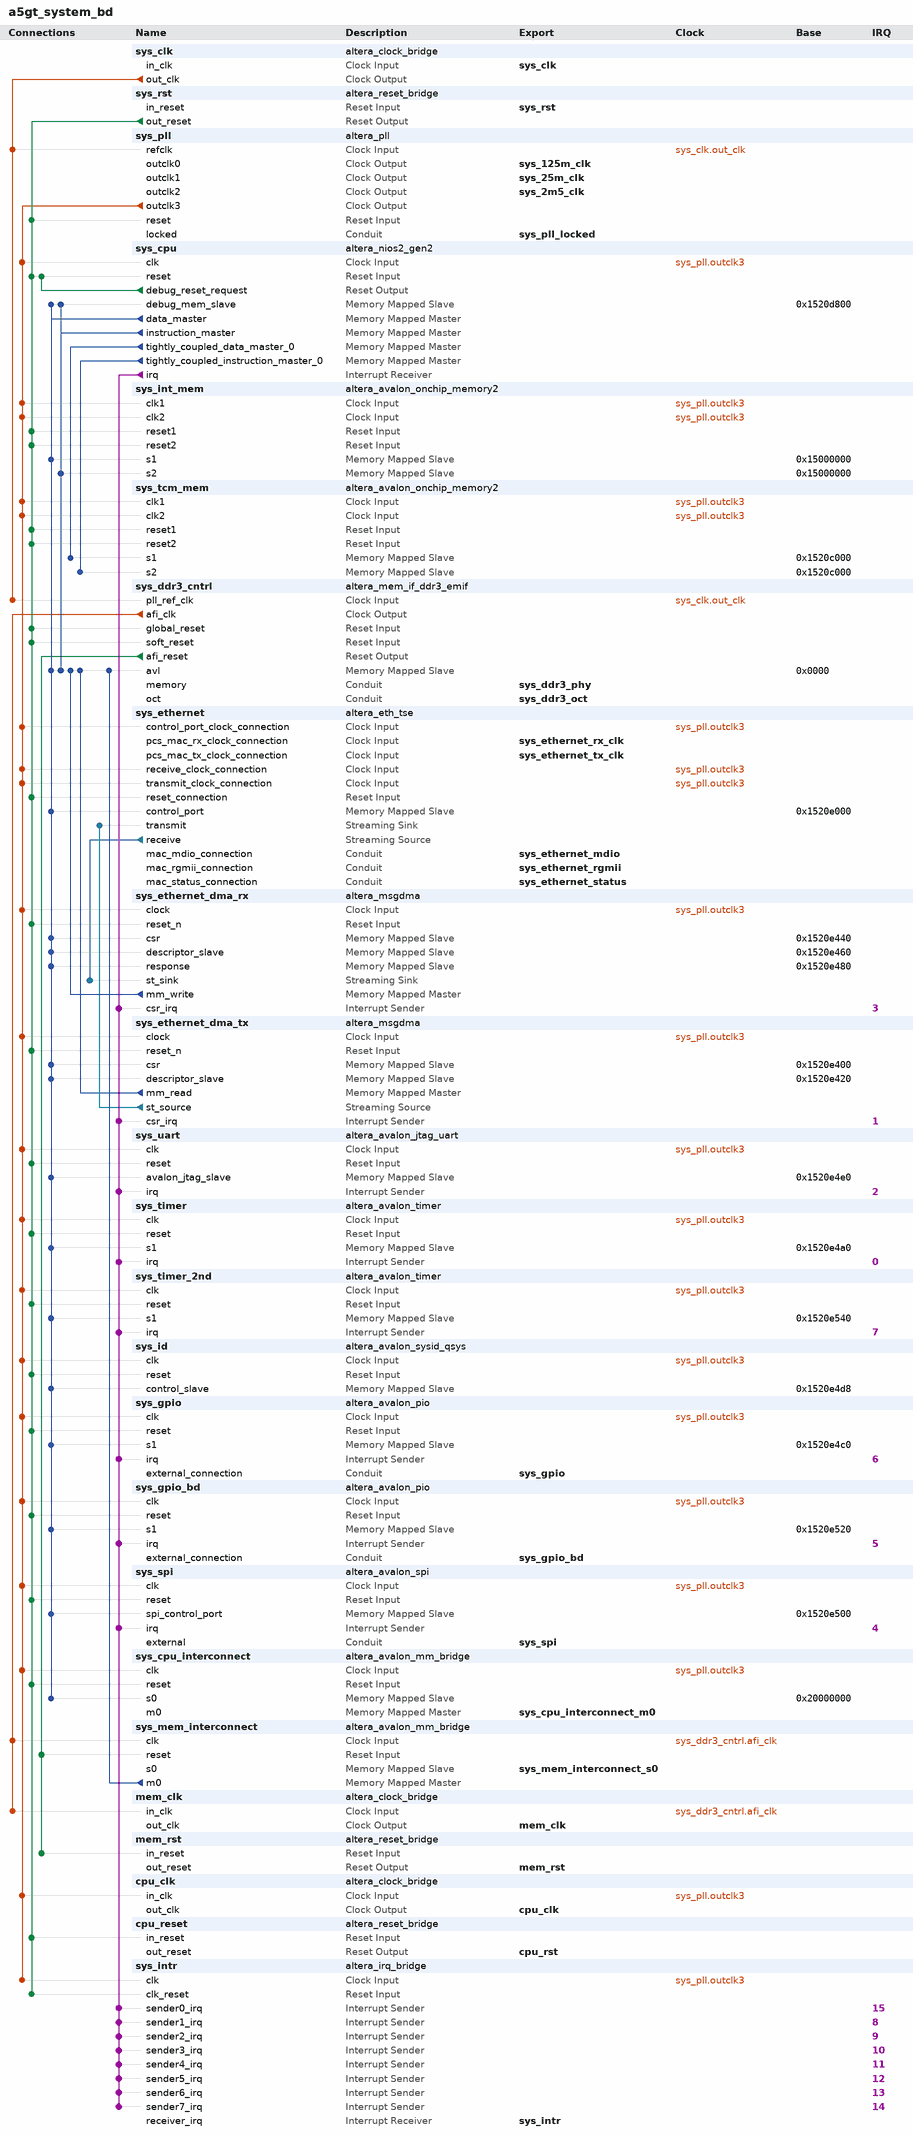
[diagram p0: system contents]
# Platform Designer (Qsys) system a5gt_system_bd, Arria V 5AGTFD7K3F40I3
# Parameters at their usual value, and those the tool derives, are not listed.
package require -exact qsys 15.1
create_system a5gt_system_bd
set_project_property DEVICE_FAMILY {Arria V}
set_project_property DEVICE 5AGTFD7K3F40I3

add_instance sys_clk altera_clock_bridge 15.1
set_instance_parameter_value sys_clk DERIVED_CLOCK_RATE 0
set_instance_parameter_value sys_clk EXPLICIT_CLOCK_RATE 1000000000

add_instance sys_rst altera_reset_bridge 15.1
set_instance_parameter_value sys_rst ACTIVE_LOW_RESET 0
set_instance_parameter_value sys_rst SYNCHRONOUS_EDGES none

add_instance sys_pll altera_pll 15.1
set_instance_parameter_value sys_pll gui_actual_output_clock_frequency1 {166.666666 MHz}
set_instance_parameter_value sys_pll gui_device_speed_grade 2
set_instance_parameter_value sys_pll gui_number_of_clocks 4
set_instance_parameter_value sys_pll gui_operation_mode direct
set_instance_parameter_value sys_pll gui_output_clock_frequency0 125.0
set_instance_parameter_value sys_pll gui_output_clock_frequency1 25.0
set_instance_parameter_value sys_pll gui_output_clock_frequency2 2.5
set_instance_parameter_value sys_pll gui_output_clock_frequency3 100.0
set_instance_parameter_value sys_pll gui_pll_mode {Integer-N PLL}
set_instance_parameter_value sys_pll gui_reference_clock_frequency 100.0
set_instance_parameter_value sys_pll gui_use_locked true

add_instance sys_cpu altera_nios2_gen2 15.1
set_instance_parameter_value sys_cpu dcache_numTCDM 1
set_instance_parameter_value sys_cpu dcache_size 32768
set_instance_parameter_value sys_cpu exceptionSlave sys_ddr3_cntrl.avl
set_instance_parameter_value sys_cpu icache_numTCIM 1
set_instance_parameter_value sys_cpu icache_size 32768
set_instance_parameter_value sys_cpu impl Fast
set_instance_parameter_value sys_cpu mmu_TLBMissExcOffset 4096
set_instance_parameter_value sys_cpu mmu_TLBMissExcSlave sys_int_mem.s2
set_instance_parameter_value sys_cpu mmu_autoAssignTlbPtrSz false
set_instance_parameter_value sys_cpu mmu_enabled true
set_instance_parameter_value sys_cpu mul_32_impl 3
set_instance_parameter_value sys_cpu resetSlave sys_ddr3_cntrl.avl
set_instance_parameter_value sys_cpu setting_activateTrace true
set_instance_parameter_value sys_cpu shift_rot_impl 0

add_instance sys_int_mem altera_avalon_onchip_memory2 15.1
set_instance_parameter_value sys_int_mem dataWidth 32
set_instance_parameter_value sys_int_mem dualPort true
set_instance_parameter_value sys_int_mem initMemContent true
set_instance_parameter_value sys_int_mem initializationFileName onchip_mem.hex
set_instance_parameter_value sys_int_mem memorySize 786432

add_instance sys_tcm_mem altera_avalon_onchip_memory2 15.1
set_instance_parameter_value sys_tcm_mem dataWidth 32
set_instance_parameter_value sys_tcm_mem dualPort true
set_instance_parameter_value sys_tcm_mem initMemContent true
set_instance_parameter_value sys_tcm_mem initializationFileName onchip_mem.hex
set_instance_parameter_value sys_tcm_mem memorySize 4096

add_instance sys_ddr3_cntrl altera_mem_if_ddr3_emif 15.1
set_instance_parameter_value sys_ddr3_cntrl AVL_MAX_SIZE 256
set_instance_parameter_value sys_ddr3_cntrl CALIBRATION_MODE Skip
set_instance_parameter_value sys_ddr3_cntrl CPORT_TYPE_PORT Bidirectional,Bidirectional,Bidirectional,Bidirectional,Bidirectional,Bidirectional
set_instance_parameter_value sys_ddr3_cntrl EXPORT_AFI_HALF_CLK false
set_instance_parameter_value sys_ddr3_cntrl HARD_EMIF false
set_instance_parameter_value sys_ddr3_cntrl MEM_BANKADDR_WIDTH 3
set_instance_parameter_value sys_ddr3_cntrl MEM_CLK_FREQ 400.0
set_instance_parameter_value sys_ddr3_cntrl MEM_CLK_FREQ_MAX 666.667
set_instance_parameter_value sys_ddr3_cntrl MEM_COL_ADDR_WIDTH 10
set_instance_parameter_value sys_ddr3_cntrl MEM_DQ_WIDTH 64
set_instance_parameter_value sys_ddr3_cntrl MEM_DRV_STR RZQ/6
set_instance_parameter_value sys_ddr3_cntrl MEM_FORMAT DISCRETE
set_instance_parameter_value sys_ddr3_cntrl MEM_ROW_ADDR_WIDTH 12
set_instance_parameter_value sys_ddr3_cntrl MEM_TCL 11
set_instance_parameter_value sys_ddr3_cntrl MEM_TFAW_NS 30.0
set_instance_parameter_value sys_ddr3_cntrl MEM_TRAS_NS 35.0
set_instance_parameter_value sys_ddr3_cntrl MEM_TRCD_NS 13.75
set_instance_parameter_value sys_ddr3_cntrl MEM_TRFC_NS 110.0
set_instance_parameter_value sys_ddr3_cntrl MEM_TRP_NS 13.75
set_instance_parameter_value sys_ddr3_cntrl MEM_TRRD_NS 6.0
set_instance_parameter_value sys_ddr3_cntrl MEM_TRTP_NS 7.5
set_instance_parameter_value sys_ddr3_cntrl MEM_TWTR 6
set_instance_parameter_value sys_ddr3_cntrl MEM_VENDOR Micron
set_instance_parameter_value sys_ddr3_cntrl MEM_WTCL 8
set_instance_parameter_value sys_ddr3_cntrl PLL_LOCATION Top_Bottom
set_instance_parameter_value sys_ddr3_cntrl POWER_OF_TWO_BUS false
set_instance_parameter_value sys_ddr3_cntrl PRIORITY_PORT 1,1,1,1,1,1
set_instance_parameter_value sys_ddr3_cntrl RATE Quarter
set_instance_parameter_value sys_ddr3_cntrl REF_CLK_FREQ 100.0
set_instance_parameter_value sys_ddr3_cntrl SPEED_GRADE 3
set_instance_parameter_value sys_ddr3_cntrl TIMING_BOARD_AC_SKEW 0.02
set_instance_parameter_value sys_ddr3_cntrl TIMING_BOARD_AC_TO_CK_SKEW 0.0
set_instance_parameter_value sys_ddr3_cntrl TIMING_BOARD_DQ_TO_DQS_SKEW 0.0
set_instance_parameter_value sys_ddr3_cntrl TIMING_BOARD_MAX_CK_DELAY 0.6
set_instance_parameter_value sys_ddr3_cntrl TIMING_BOARD_MAX_DQS_DELAY 0.6
set_instance_parameter_value sys_ddr3_cntrl TIMING_BOARD_SKEW_BETWEEN_DQS 0.02
set_instance_parameter_value sys_ddr3_cntrl TIMING_BOARD_SKEW_CKDQS_DIMM_MAX 0.01
set_instance_parameter_value sys_ddr3_cntrl TIMING_BOARD_SKEW_CKDQS_DIMM_MIN -0.01
set_instance_parameter_value sys_ddr3_cntrl TIMING_BOARD_SKEW_WITHIN_DQS 0.02
set_instance_parameter_value sys_ddr3_cntrl TIMING_TDH 45
set_instance_parameter_value sys_ddr3_cntrl TIMING_TDQSCK 255
set_instance_parameter_value sys_ddr3_cntrl TIMING_TDQSQ 100
set_instance_parameter_value sys_ddr3_cntrl TIMING_TDQSS 0.27
set_instance_parameter_value sys_ddr3_cntrl TIMING_TDS 10
set_instance_parameter_value sys_ddr3_cntrl TIMING_TDSH 0.18
set_instance_parameter_value sys_ddr3_cntrl TIMING_TDSS 0.18
set_instance_parameter_value sys_ddr3_cntrl TIMING_TIH 120
set_instance_parameter_value sys_ddr3_cntrl TIMING_TIS 170
set_instance_parameter_value sys_ddr3_cntrl TIMING_TQSH 0.4
set_instance_parameter_value sys_ddr3_cntrl USER_DEBUG_LEVEL 1

add_instance sys_ethernet altera_eth_tse 15.1
set_instance_parameter_value sys_ethernet core_variation MAC_ONLY
set_instance_parameter_value sys_ethernet enable_hd_logic true
set_instance_parameter_value sys_ethernet enable_mac_flow_ctrl true
set_instance_parameter_value sys_ethernet enable_magic_detect true
set_instance_parameter_value sys_ethernet enable_shift16 true
set_instance_parameter_value sys_ethernet ifGMII RGMII
set_instance_parameter_value sys_ethernet ing_addr 11
set_instance_parameter_value sys_ethernet mdio_clk_div 30
set_instance_parameter_value sys_ethernet stat_cnt_ena true
set_instance_parameter_value sys_ethernet transceiver_type NONE

add_instance sys_ethernet_dma_rx altera_msgdma 15.1
set_instance_parameter_value sys_ethernet_dma_rx BURST_ENABLE 1
set_instance_parameter_value sys_ethernet_dma_rx DATA_FIFO_DEPTH 256
set_instance_parameter_value sys_ethernet_dma_rx DATA_WIDTH 64
set_instance_parameter_value sys_ethernet_dma_rx DESCRIPTOR_FIFO_DEPTH 512
set_instance_parameter_value sys_ethernet_dma_rx ENHANCED_FEATURES 1
set_instance_parameter_value sys_ethernet_dma_rx ERROR_ENABLE 1
set_instance_parameter_value sys_ethernet_dma_rx ERROR_WIDTH 6
set_instance_parameter_value sys_ethernet_dma_rx MAX_BURST_COUNT 64
set_instance_parameter_value sys_ethernet_dma_rx MAX_BYTE 2048
set_instance_parameter_value sys_ethernet_dma_rx MODE 2
set_instance_parameter_value sys_ethernet_dma_rx PACKET_ENABLE 1
set_instance_parameter_value sys_ethernet_dma_rx RESPONSE_PORT 0
set_instance_parameter_value sys_ethernet_dma_rx TRANSFER_TYPE {Unaligned Accesses}

add_instance sys_ethernet_dma_tx altera_msgdma 15.1
set_instance_parameter_value sys_ethernet_dma_tx BURST_ENABLE 1
set_instance_parameter_value sys_ethernet_dma_tx DATA_FIFO_DEPTH 256
set_instance_parameter_value sys_ethernet_dma_tx DATA_WIDTH 64
set_instance_parameter_value sys_ethernet_dma_tx DESCRIPTOR_FIFO_DEPTH 512
set_instance_parameter_value sys_ethernet_dma_tx ENHANCED_FEATURES 1
set_instance_parameter_value sys_ethernet_dma_tx ERROR_ENABLE 1
set_instance_parameter_value sys_ethernet_dma_tx ERROR_WIDTH 1
set_instance_parameter_value sys_ethernet_dma_tx MAX_BURST_COUNT 64
set_instance_parameter_value sys_ethernet_dma_tx MAX_BYTE 2048
set_instance_parameter_value sys_ethernet_dma_tx MODE 1
set_instance_parameter_value sys_ethernet_dma_tx PACKET_ENABLE 1
set_instance_parameter_value sys_ethernet_dma_tx TRANSFER_TYPE {Unaligned Accesses}

add_instance sys_uart altera_avalon_jtag_uart 15.1
set_instance_parameter_value sys_uart simInteractiveOptions NO_INTERACTIVE_WINDOWS

add_instance sys_timer altera_avalon_timer 15.1
set_instance_parameter_value sys_timer period 1
set_instance_parameter_value sys_timer periodUnits MSEC

add_instance sys_timer_2nd altera_avalon_timer 15.1
set_instance_parameter_value sys_timer_2nd period 1
set_instance_parameter_value sys_timer_2nd periodUnits MSEC

add_instance sys_id altera_avalon_sysid_qsys 15.1
set_instance_parameter_value sys_id id 0

add_instance sys_gpio altera_avalon_pio 15.1
set_instance_parameter_value sys_gpio direction InOut
set_instance_parameter_value sys_gpio generateIRQ true
set_instance_parameter_value sys_gpio width 32

add_instance sys_gpio_bd altera_avalon_pio 15.1
set_instance_parameter_value sys_gpio_bd direction InOut
set_instance_parameter_value sys_gpio_bd generateIRQ true
set_instance_parameter_value sys_gpio_bd width 32

add_instance sys_spi altera_avalon_spi 15.1
set_instance_parameter_value sys_spi clockPolarity 0
set_instance_parameter_value sys_spi dataWidth 8
set_instance_parameter_value sys_spi masterSPI true
set_instance_parameter_value sys_spi numberOfSlaves 1
set_instance_parameter_value sys_spi targetClockRate 128000

add_instance sys_cpu_interconnect altera_avalon_mm_bridge 15.1
set_instance_parameter_value sys_cpu_interconnect ADDRESS_UNITS SYMBOLS
set_instance_parameter_value sys_cpu_interconnect ADDRESS_WIDTH 24
set_instance_parameter_value sys_cpu_interconnect DATA_WIDTH 32
set_instance_parameter_value sys_cpu_interconnect MAX_PENDING_RESPONSES 4
set_instance_parameter_value sys_cpu_interconnect USE_AUTO_ADDRESS_WIDTH 0

add_instance sys_mem_interconnect altera_avalon_mm_bridge 15.1
set_instance_parameter_value sys_mem_interconnect ADDRESS_UNITS SYMBOLS
set_instance_parameter_value sys_mem_interconnect ADDRESS_WIDTH 29
set_instance_parameter_value sys_mem_interconnect DATA_WIDTH 256
set_instance_parameter_value sys_mem_interconnect MAX_BURST_SIZE 64
set_instance_parameter_value sys_mem_interconnect MAX_PENDING_RESPONSES 4
set_instance_parameter_value sys_mem_interconnect USE_AUTO_ADDRESS_WIDTH 1

add_instance mem_clk altera_clock_bridge 15.1
set_instance_parameter_value mem_clk DERIVED_CLOCK_RATE 100000000
set_instance_parameter_value mem_clk EXPLICIT_CLOCK_RATE 0

add_instance mem_rst altera_reset_bridge 15.1
set_instance_parameter_value mem_rst ACTIVE_LOW_RESET 0
set_instance_parameter_value mem_rst SYNCHRONOUS_EDGES none

add_instance cpu_clk altera_clock_bridge 15.1
set_instance_parameter_value cpu_clk DERIVED_CLOCK_RATE 100000000
set_instance_parameter_value cpu_clk EXPLICIT_CLOCK_RATE 0

add_instance cpu_reset altera_reset_bridge 15.1
set_instance_parameter_value cpu_reset ACTIVE_LOW_RESET 0
set_instance_parameter_value cpu_reset SYNCHRONOUS_EDGES none

add_instance sys_intr altera_irq_bridge 15.1
set_instance_parameter_value sys_intr IRQ_WIDTH 8

# connections
add_connection sys_clk.out_clk sys_ddr3_cntrl.pll_ref_clk clock
add_connection sys_clk.out_clk sys_pll.refclk clock
add_connection sys_ddr3_cntrl.afi_clk mem_clk.in_clk clock
add_connection sys_ddr3_cntrl.afi_clk sys_mem_interconnect.clk clock
add_connection sys_pll.outclk3 cpu_clk.in_clk clock
add_connection sys_pll.outclk3 sys_cpu.clk clock
add_connection sys_pll.outclk3 sys_cpu_interconnect.clk clock
add_connection sys_pll.outclk3 sys_ethernet.control_port_clock_connection clock
add_connection sys_pll.outclk3 sys_ethernet.receive_clock_connection clock
add_connection sys_pll.outclk3 sys_ethernet.transmit_clock_connection clock
add_connection sys_pll.outclk3 sys_ethernet_dma_rx.clock clock
add_connection sys_pll.outclk3 sys_ethernet_dma_tx.clock clock
add_connection sys_pll.outclk3 sys_gpio.clk clock
add_connection sys_pll.outclk3 sys_gpio_bd.clk clock
add_connection sys_pll.outclk3 sys_id.clk clock
add_connection sys_pll.outclk3 sys_int_mem.clk1 clock
add_connection sys_pll.outclk3 sys_int_mem.clk2 clock
add_connection sys_pll.outclk3 sys_intr.clk clock
add_connection sys_pll.outclk3 sys_spi.clk clock
add_connection sys_pll.outclk3 sys_tcm_mem.clk1 clock
add_connection sys_pll.outclk3 sys_tcm_mem.clk2 clock
add_connection sys_pll.outclk3 sys_timer.clk clock
add_connection sys_pll.outclk3 sys_timer_2nd.clk clock
add_connection sys_pll.outclk3 sys_uart.clk clock
add_connection sys_cpu.debug_reset_request sys_cpu.reset reset
add_connection sys_ddr3_cntrl.afi_reset mem_rst.in_reset reset
add_connection sys_ddr3_cntrl.afi_reset sys_mem_interconnect.reset reset
add_connection sys_rst.out_reset cpu_reset.in_reset reset
add_connection sys_rst.out_reset sys_cpu.reset reset
add_connection sys_rst.out_reset sys_cpu_interconnect.reset reset
add_connection sys_rst.out_reset sys_ddr3_cntrl.global_reset reset
add_connection sys_rst.out_reset sys_ddr3_cntrl.soft_reset reset
add_connection sys_rst.out_reset sys_ethernet.reset_connection reset
add_connection sys_rst.out_reset sys_ethernet_dma_rx.reset_n reset
add_connection sys_rst.out_reset sys_ethernet_dma_tx.reset_n reset
add_connection sys_rst.out_reset sys_gpio.reset reset
add_connection sys_rst.out_reset sys_gpio_bd.reset reset
add_connection sys_rst.out_reset sys_id.reset reset
add_connection sys_rst.out_reset sys_int_mem.reset1 reset
add_connection sys_rst.out_reset sys_int_mem.reset2 reset
add_connection sys_rst.out_reset sys_intr.clk_reset reset
add_connection sys_rst.out_reset sys_pll.reset reset
add_connection sys_rst.out_reset sys_spi.reset reset
add_connection sys_rst.out_reset sys_tcm_mem.reset1 reset
add_connection sys_rst.out_reset sys_tcm_mem.reset2 reset
add_connection sys_rst.out_reset sys_timer.reset reset
add_connection sys_rst.out_reset sys_timer_2nd.reset reset
add_connection sys_rst.out_reset sys_uart.reset reset
add_connection sys_cpu.data_master sys_cpu.debug_mem_slave avalon
set_connection_parameter_value sys_cpu.data_master/sys_cpu.debug_mem_slave baseAddress 0x1520d800
add_connection sys_cpu.data_master sys_cpu_interconnect.s0 avalon
set_connection_parameter_value sys_cpu.data_master/sys_cpu_interconnect.s0 baseAddress 0x20000000
add_connection sys_cpu.data_master sys_ddr3_cntrl.avl avalon
set_connection_parameter_value sys_cpu.data_master/sys_ddr3_cntrl.avl baseAddress 0x0000
add_connection sys_cpu.data_master sys_ethernet.control_port avalon
set_connection_parameter_value sys_cpu.data_master/sys_ethernet.control_port baseAddress 0x1520e000
add_connection sys_cpu.data_master sys_ethernet_dma_rx.csr avalon
set_connection_parameter_value sys_cpu.data_master/sys_ethernet_dma_rx.csr baseAddress 0x1520e440
add_connection sys_cpu.data_master sys_ethernet_dma_rx.descriptor_slave avalon
set_connection_parameter_value sys_cpu.data_master/sys_ethernet_dma_rx.descriptor_slave baseAddress 0x1520e460
add_connection sys_cpu.data_master sys_ethernet_dma_rx.response avalon
set_connection_parameter_value sys_cpu.data_master/sys_ethernet_dma_rx.response baseAddress 0x1520e480
add_connection sys_cpu.data_master sys_ethernet_dma_tx.csr avalon
set_connection_parameter_value sys_cpu.data_master/sys_ethernet_dma_tx.csr baseAddress 0x1520e400
add_connection sys_cpu.data_master sys_ethernet_dma_tx.descriptor_slave avalon
set_connection_parameter_value sys_cpu.data_master/sys_ethernet_dma_tx.descriptor_slave baseAddress 0x1520e420
add_connection sys_cpu.data_master sys_gpio.s1 avalon
set_connection_parameter_value sys_cpu.data_master/sys_gpio.s1 baseAddress 0x1520e4c0
add_connection sys_cpu.data_master sys_gpio_bd.s1 avalon
set_connection_parameter_value sys_cpu.data_master/sys_gpio_bd.s1 baseAddress 0x1520e520
add_connection sys_cpu.data_master sys_id.control_slave avalon
set_connection_parameter_value sys_cpu.data_master/sys_id.control_slave baseAddress 0x1520e4d8
add_connection sys_cpu.data_master sys_int_mem.s1 avalon
set_connection_parameter_value sys_cpu.data_master/sys_int_mem.s1 baseAddress 0x15000000
add_connection sys_cpu.data_master sys_spi.spi_control_port avalon
set_connection_parameter_value sys_cpu.data_master/sys_spi.spi_control_port baseAddress 0x1520e500
add_connection sys_cpu.data_master sys_timer.s1 avalon
set_connection_parameter_value sys_cpu.data_master/sys_timer.s1 baseAddress 0x1520e4a0
add_connection sys_cpu.data_master sys_timer_2nd.s1 avalon
set_connection_parameter_value sys_cpu.data_master/sys_timer_2nd.s1 baseAddress 0x1520e540
add_connection sys_cpu.data_master sys_uart.avalon_jtag_slave avalon
set_connection_parameter_value sys_cpu.data_master/sys_uart.avalon_jtag_slave baseAddress 0x1520e4e0
add_connection sys_cpu.instruction_master sys_cpu.debug_mem_slave avalon
set_connection_parameter_value sys_cpu.instruction_master/sys_cpu.debug_mem_slave baseAddress 0x1520d800
add_connection sys_cpu.instruction_master sys_ddr3_cntrl.avl avalon
set_connection_parameter_value sys_cpu.instruction_master/sys_ddr3_cntrl.avl baseAddress 0x0000
add_connection sys_cpu.instruction_master sys_int_mem.s2 avalon
set_connection_parameter_value sys_cpu.instruction_master/sys_int_mem.s2 baseAddress 0x15000000
add_connection sys_cpu.tightly_coupled_data_master_0 sys_tcm_mem.s1 avalon
set_connection_parameter_value sys_cpu.tightly_coupled_data_master_0/sys_tcm_mem.s1 baseAddress 0x1520c000
add_connection sys_cpu.tightly_coupled_instruction_master_0 sys_tcm_mem.s2 avalon
set_connection_parameter_value sys_cpu.tightly_coupled_instruction_master_0/sys_tcm_mem.s2 baseAddress 0x1520c000
add_connection sys_ethernet_dma_rx.mm_write sys_ddr3_cntrl.avl avalon
set_connection_parameter_value sys_ethernet_dma_rx.mm_write/sys_ddr3_cntrl.avl baseAddress 0x0000
add_connection sys_ethernet_dma_tx.mm_read sys_ddr3_cntrl.avl avalon
set_connection_parameter_value sys_ethernet_dma_tx.mm_read/sys_ddr3_cntrl.avl baseAddress 0x0000
add_connection sys_mem_interconnect.m0 sys_ddr3_cntrl.avl avalon
set_connection_parameter_value sys_mem_interconnect.m0/sys_ddr3_cntrl.avl baseAddress 0x0000
add_connection sys_ethernet.receive sys_ethernet_dma_rx.st_sink avalon_streaming
add_connection sys_ethernet_dma_tx.st_source sys_ethernet.transmit avalon_streaming
add_connection sys_cpu.irq sys_ethernet_dma_rx.csr_irq interrupt
set_connection_parameter_value sys_cpu.irq/sys_ethernet_dma_rx.csr_irq irqNumber 3
add_connection sys_cpu.irq sys_ethernet_dma_tx.csr_irq interrupt
set_connection_parameter_value sys_cpu.irq/sys_ethernet_dma_tx.csr_irq irqNumber 1
add_connection sys_cpu.irq sys_gpio.irq interrupt
set_connection_parameter_value sys_cpu.irq/sys_gpio.irq irqNumber 6
add_connection sys_cpu.irq sys_gpio_bd.irq interrupt
set_connection_parameter_value sys_cpu.irq/sys_gpio_bd.irq irqNumber 5
add_connection sys_cpu.irq sys_intr.sender0_irq interrupt
set_connection_parameter_value sys_cpu.irq/sys_intr.sender0_irq irqNumber 15
add_connection sys_cpu.irq sys_intr.sender1_irq interrupt
set_connection_parameter_value sys_cpu.irq/sys_intr.sender1_irq irqNumber 8
add_connection sys_cpu.irq sys_intr.sender2_irq interrupt
set_connection_parameter_value sys_cpu.irq/sys_intr.sender2_irq irqNumber 9
add_connection sys_cpu.irq sys_intr.sender3_irq interrupt
set_connection_parameter_value sys_cpu.irq/sys_intr.sender3_irq irqNumber 10
add_connection sys_cpu.irq sys_intr.sender4_irq interrupt
set_connection_parameter_value sys_cpu.irq/sys_intr.sender4_irq irqNumber 11
add_connection sys_cpu.irq sys_intr.sender5_irq interrupt
set_connection_parameter_value sys_cpu.irq/sys_intr.sender5_irq irqNumber 12
add_connection sys_cpu.irq sys_intr.sender6_irq interrupt
set_connection_parameter_value sys_cpu.irq/sys_intr.sender6_irq irqNumber 13
add_connection sys_cpu.irq sys_intr.sender7_irq interrupt
set_connection_parameter_value sys_cpu.irq/sys_intr.sender7_irq irqNumber 14
add_connection sys_cpu.irq sys_spi.irq interrupt
set_connection_parameter_value sys_cpu.irq/sys_spi.irq irqNumber 4
add_connection sys_cpu.irq sys_timer.irq interrupt
set_connection_parameter_value sys_cpu.irq/sys_timer.irq irqNumber 0
add_connection sys_cpu.irq sys_timer_2nd.irq interrupt
set_connection_parameter_value sys_cpu.irq/sys_timer_2nd.irq irqNumber 7
add_connection sys_cpu.irq sys_uart.irq interrupt
set_connection_parameter_value sys_cpu.irq/sys_uart.irq irqNumber 2

# exported interfaces
add_interface cpu_clk clock source
set_interface_property cpu_clk EXPORT_OF cpu_clk.out_clk
add_interface cpu_rst reset source
set_interface_property cpu_rst EXPORT_OF cpu_reset.out_reset
add_interface mem_clk clock source
set_interface_property mem_clk EXPORT_OF mem_clk.out_clk
add_interface mem_rst reset source
set_interface_property mem_rst EXPORT_OF mem_rst.out_reset
add_interface sys_125m_clk clock source
set_interface_property sys_125m_clk EXPORT_OF sys_pll.outclk0
add_interface sys_25m_clk clock source
set_interface_property sys_25m_clk EXPORT_OF sys_pll.outclk1
add_interface sys_2m5_clk clock source
set_interface_property sys_2m5_clk EXPORT_OF sys_pll.outclk2
add_interface sys_clk clock sink
set_interface_property sys_clk EXPORT_OF sys_clk.in_clk
add_interface sys_cpu_interconnect_m0 avalon master
set_interface_property sys_cpu_interconnect_m0 EXPORT_OF sys_cpu_interconnect.m0
add_interface sys_ddr3_oct conduit end
set_interface_property sys_ddr3_oct EXPORT_OF sys_ddr3_cntrl.oct
add_interface sys_ddr3_phy conduit end
set_interface_property sys_ddr3_phy EXPORT_OF sys_ddr3_cntrl.memory
add_interface sys_ethernet_mdio conduit end
set_interface_property sys_ethernet_mdio EXPORT_OF sys_ethernet.mac_mdio_connection
add_interface sys_ethernet_rgmii conduit end
set_interface_property sys_ethernet_rgmii EXPORT_OF sys_ethernet.mac_rgmii_connection
add_interface sys_ethernet_rx_clk clock sink
set_interface_property sys_ethernet_rx_clk EXPORT_OF sys_ethernet.pcs_mac_rx_clock_connection
add_interface sys_ethernet_status conduit end
set_interface_property sys_ethernet_status EXPORT_OF sys_ethernet.mac_status_connection
add_interface sys_ethernet_tx_clk clock sink
set_interface_property sys_ethernet_tx_clk EXPORT_OF sys_ethernet.pcs_mac_tx_clock_connection
add_interface sys_gpio conduit end
set_interface_property sys_gpio EXPORT_OF sys_gpio.external_connection
add_interface sys_gpio_bd conduit end
set_interface_property sys_gpio_bd EXPORT_OF sys_gpio_bd.external_connection
add_interface sys_intr interrupt receiver
set_interface_property sys_intr EXPORT_OF sys_intr.receiver_irq
add_interface sys_mem_interconnect_s0 avalon slave
set_interface_property sys_mem_interconnect_s0 EXPORT_OF sys_mem_interconnect.s0
add_interface sys_pll_locked conduit end
set_interface_property sys_pll_locked EXPORT_OF sys_pll.locked
add_interface sys_rst reset sink
set_interface_property sys_rst EXPORT_OF sys_rst.in_reset
add_interface sys_spi conduit end
set_interface_property sys_spi EXPORT_OF sys_spi.external

set_interconnect_requirement {$system} qsys_mm.clockCrossingAdapter FIFO
set_interconnect_requirement {$system} qsys_mm.insertDefaultSlave false
set_interconnect_requirement {$system} qsys_mm.maxAdditionalLatency 2

save_system a5gt_system_bd.qsys
